# EAGLE design receivera (EAGLE 9.5.2)
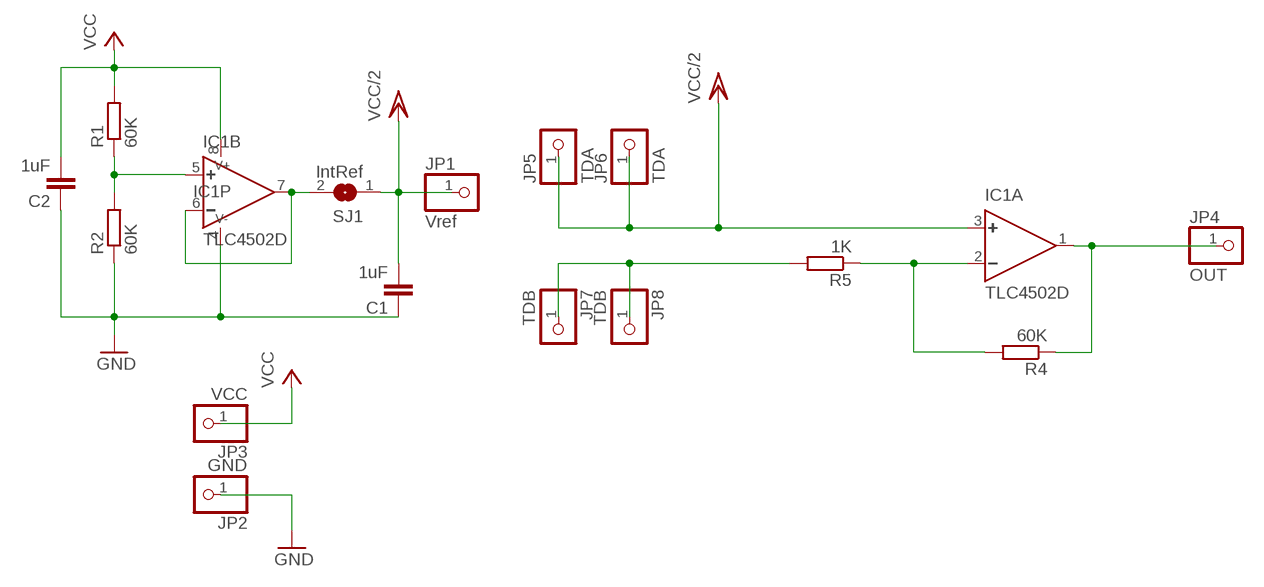
[diagram p0: schematic, sheet 1]

## Parts
C1  1uF  C-EUC1206  [C1206]
C2  1uF  C-EUC1206  [C1206]
IC1  TLC4502D  [D_R-PDSO-G08]
JP1  Vref  PINHD-1X1  [1X01]
JP2  GND  PINHD-1X1  [1X01]
JP3  VCC  PINHD-1X1  [1X01]
JP4  OUT  PINHD-1X1  [1X01]
JP5  TDA  PINHD-1X1  [1X01]
JP6  TDA  PINHD-1X1  [1X01]
JP7  TDB  PINHD-1X1  [1X01]
JP8  TDB  PINHD-1X1  [1X01]
R1  60K  R-EU_R1206  [R1206]
R2  60K  R-EU_R1206  [R1206]
R4  60K  R-EU_R1206  [R1206]
R5  1K  R-EU_R1206  [R1206]
SJ1  IntRef  SJ  [SJ]

## Nets
GND: C1.1 C2.1 IC1.4(P:V-) JP2.1 R2.1
N$1: IC1.5(B:+) R1.1 R2.2
N$2: IC1.1(A:OUT) JP4.1 R4.1
N$3: JP7.1 JP8.1 R5.2
N$4: IC1.2(A:-) R4.2 R5.1
N$6: IC1.6(B:-) IC1.7(B:OUT) SJ1.2
VCC: C2.2 IC1.8(P:V+) JP3.1 R1.2
VCC/2: C1.2 IC1.3(A:+) JP1.1 JP5.1 JP6.1 SJ1.1

## Library data of the parts
C1 C2 = rcl:C-EU: CAPACITOR, European symbol; SPICEPREFIX: C
IC1 = texas:TLC4502: FAMILY OF SELF-CALIBRATING (Self-Cal TM) PRECISION CMOS RAIL-TO-RAIL OUTPUT OPERATIONAL AMPLIFIERS Source: Data sheet <http://www.ti.com/lit/ds/symlink/tlc4502.pdf>
JP1-JP8 = pinhead:PINHD-1X1: PIN HEADER
R1 R2 R4 R5 = rcl:R-EU_: RESISTOR, European symbol; SPICEPREFIX: R
SJ1 = jumper:SJ: SMD solder JUMPER

## Board
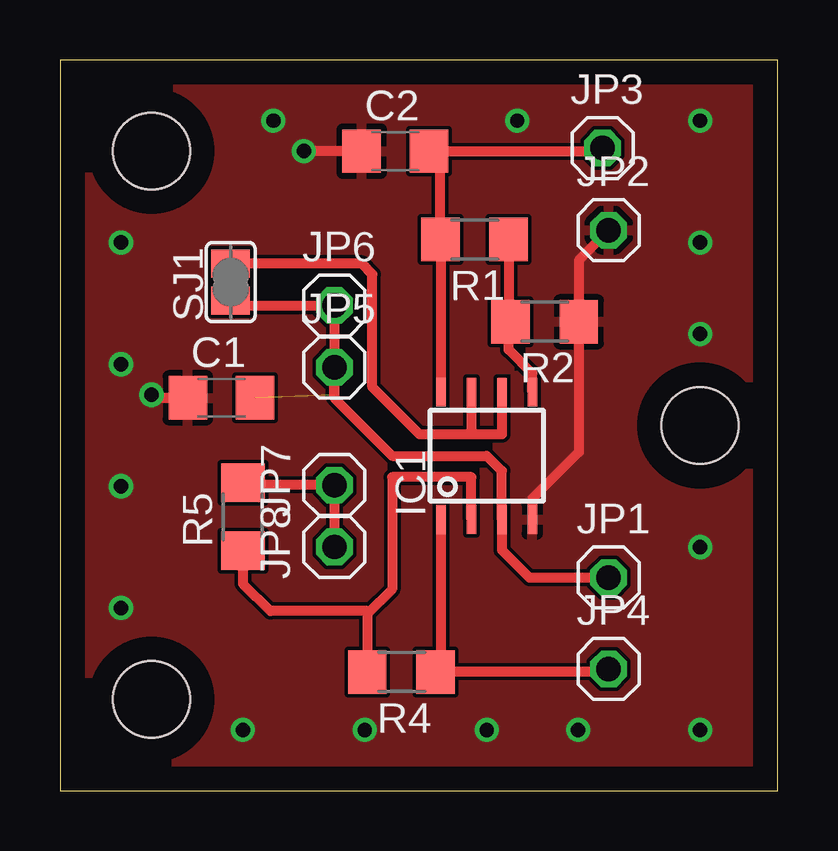
[diagram p1: board, top side]
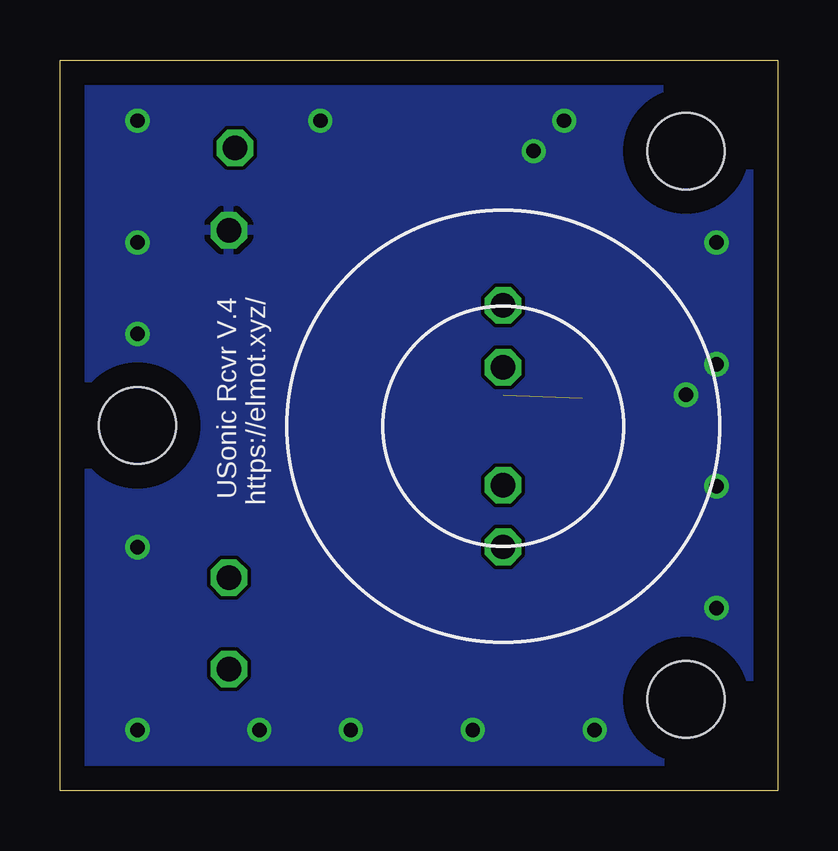
[diagram p2: board, bottom side, seen from below]

Size 29.9 x 30.47 mm. Coordinates in mm from the lower left corner, seen from the top.
Outline: 0,0 29.9,0 29.9,30.47 0,30.47 0,0
Copper layers (1*16): Top 0.035mm / dielectric 1.5mm / Bottom 0.035mm
Design rules "default": minimum track width 6mil, minimum drill 0.35mm, track to track 6mil, track to pad 6mil, pad to pad 6mil, via to via 6mil, smd to smd 6mil, copper to edge 40mil, drill to drill 6mil, minimum pad ring 10mil, minimum via ring 8mil, stop-mask expansion 4mil, vias tented up to drill 0mil, thermal gap 10mil
Holes 3.2 mm at 3.81,26.67 3.81,3.81 26.67,15.23

### Footprints (pad centres in the part's own frame; a part is rotated, then mirrored left to right if it is on the bottom)
C1206 = smd 1.6 x 1.8: 1 -1.4,0; 2 1.4,0
D_R-PDSO-G08 = smd 0.4 x 1.2: 1 -1.905,-2.65; 2 -0.635,-2.65; 3 0.635,-2.65; 4 1.905,-2.65; 5 1.905,2.65; 6 0.635,2.65; 7 -0.635,2.65; 8 -1.905,2.65
1X01 = drill 1.016 octagon: 1 0,0
R1206 = smd 1.6 x 1.803: 1 -1.422,0; 2 1.422,0
SJ = smd 1.168 x 1.6: 1 -0.762,0; 2 0.762,0

### Placement (x,y rotation side)
C1  6.73,16.38 0 top
C2  13.97,26.67 0 top
IC1  17.78,13.97 0 top
JP1  22.86,8.89 0 top
JP2  22.86,23.37 0 top
JP3  22.61,26.8 0 top
JP4  22.86,5.08 0 top
JP5  11.43,17.65 0 top
JP6  11.43,20.23 0 top
JP7  11.43,12.75 90 top
JP8  11.43,10.17 90 top
R1  17.27,22.99 180 top
R2  20.19,19.56 180 top
R4  14.22,4.95 180 top
R5  7.62,11.43 90 top
SJ1  7.11,21.21 90 top

### Tracks (layer width: path | path; a pad name or v marks a point on that pad's centre or on a via)
GND  (via drill 0.6)
  Top 0.406: v3.81,16.51 3.94,16.38 C1.1 | C2.1 v10.16,26.67 | JP2.1 21.61,22.12 R2.1 21.61,14.12 19.68,12.19 IC1.4
  other vias: 2.54,22.86 2.54,17.78 2.54,12.7 2.54,7.62 7.62,2.54 12.7,2.54 17.78,2.54 21.59,2.54 26.67,2.54 26.67,10.16 26.67,19.05 26.67,22.86 26.67,27.94 19.05,27.94 8.89,27.94
  pour Bottom: 0,30.48 29.97,30.48 29.97,0 0,0
  pour Top: 29.97,30.48 0,30.48 0,0 29.97,0
N$1
  Top 0.406: R1.1 18.69,19.64 | 18.69,19.64 R2.2 | IC1.5 19.68,17.4 18.69,18.39 18.69,19.64
N$2
  Top 0.406: IC1.1 15.88,5.18 R4.1 22.86,4.95 JP4.1
N$3
  Top 0.406: JP8.1 JP7.1 7.72,12.75 R5.2
N$4
  Top 0.406: IC1.2 17.14,13.08 13.84,13.08 13.84,8.41 12.8,7.37 R4.2 12.8,7.49 8.76,7.49 7.62,8.64 R5.1
N$6
  Top 0.406: 17.27,14.86 14.99,14.86 13.02,16.83 13.02,21.53 12.57,21.97 SJ1.2 | IC1.6 18.41,14.86 17.27,14.86 | IC1.7 17.14,14.99 17.27,14.86
VCC
  Top 0.406: IC1.8 15.88,22.96 R1.2 15.85,26.19 C2.2 22.48,26.67 JP3.1
VCC/2  (1 unrouted)
  Top 0.406: JP5.1 11.43,16.51 | JP5.1 JP6.1 7.33,20.23 SJ1.1 | JP5.1 11.43,16.38 13.84,13.97 17.78,13.97 18.41,13.34 IC1.3 18.41,10.03 19.56,8.89 JP1.1 | C1.2 8.13,16.51

### Text on the board
bPlace: USonic Rcvr V.4 / https://elmot.xyz/